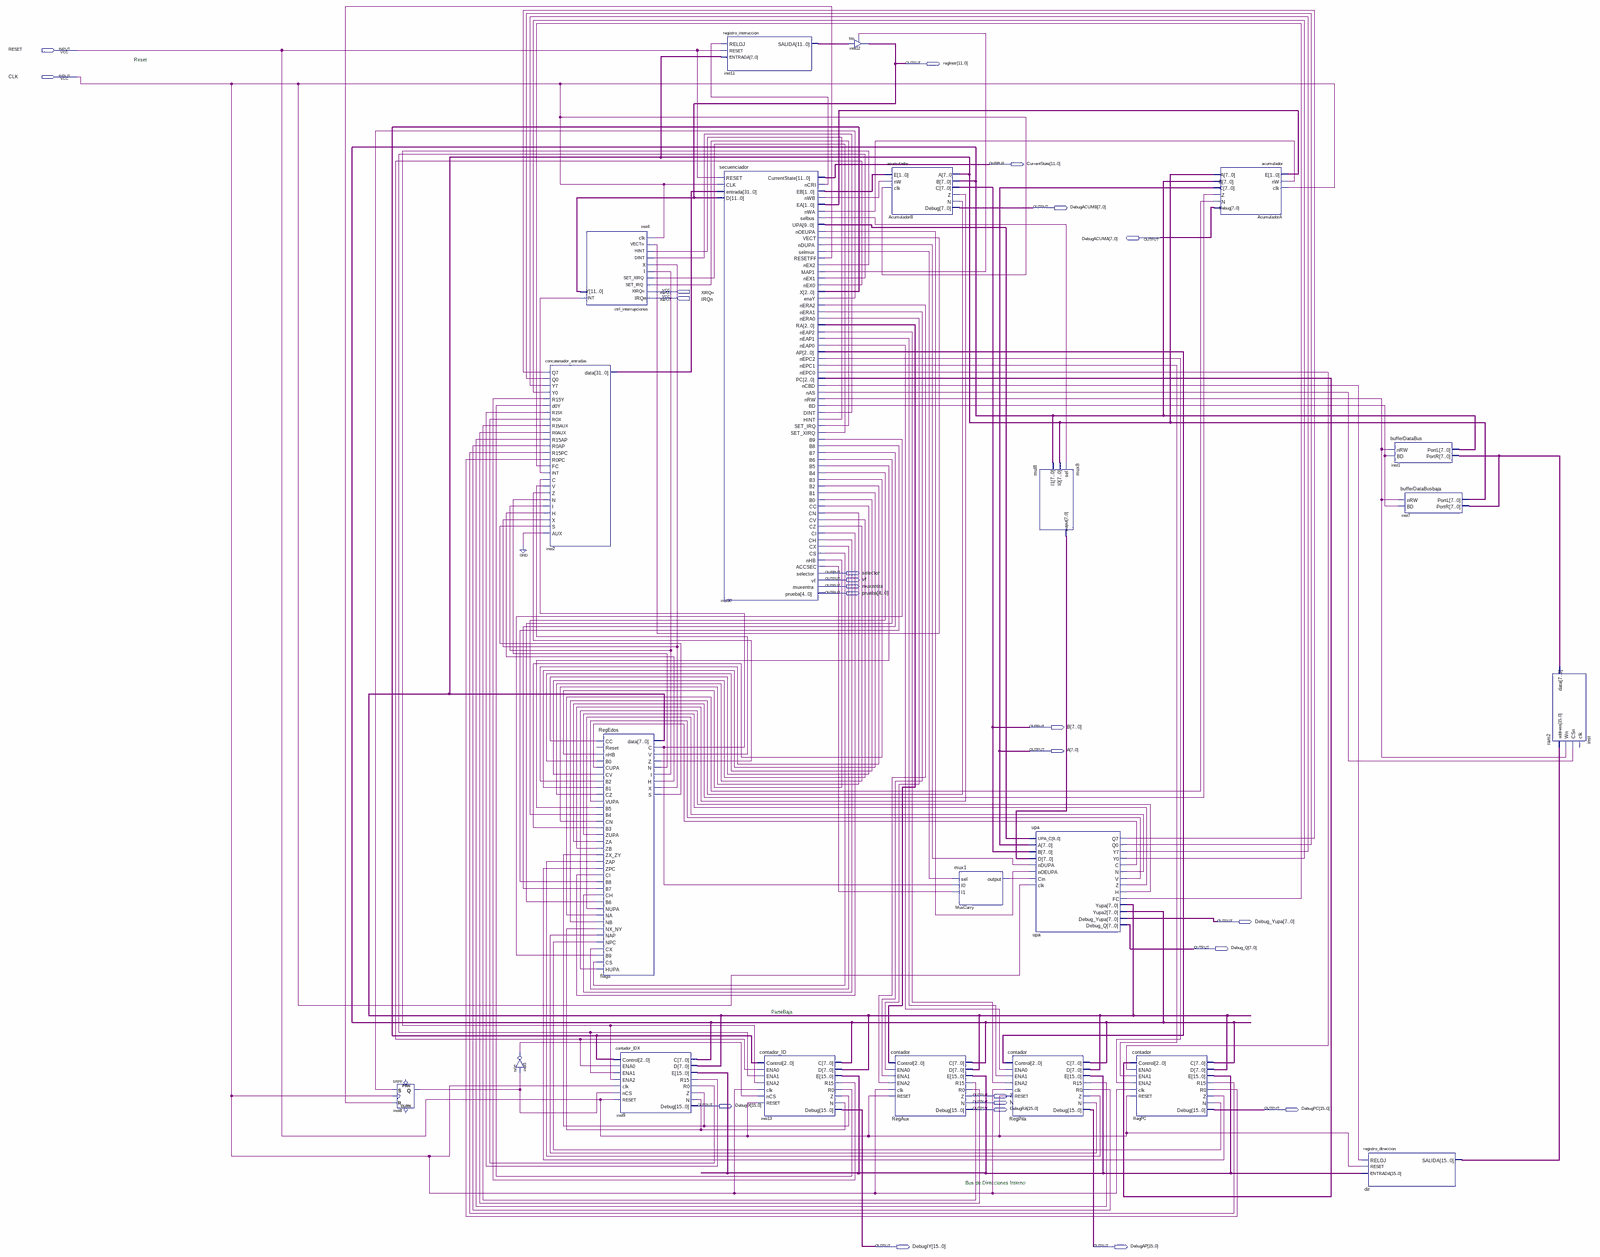
[diagram p0: schematic sheet, whole]
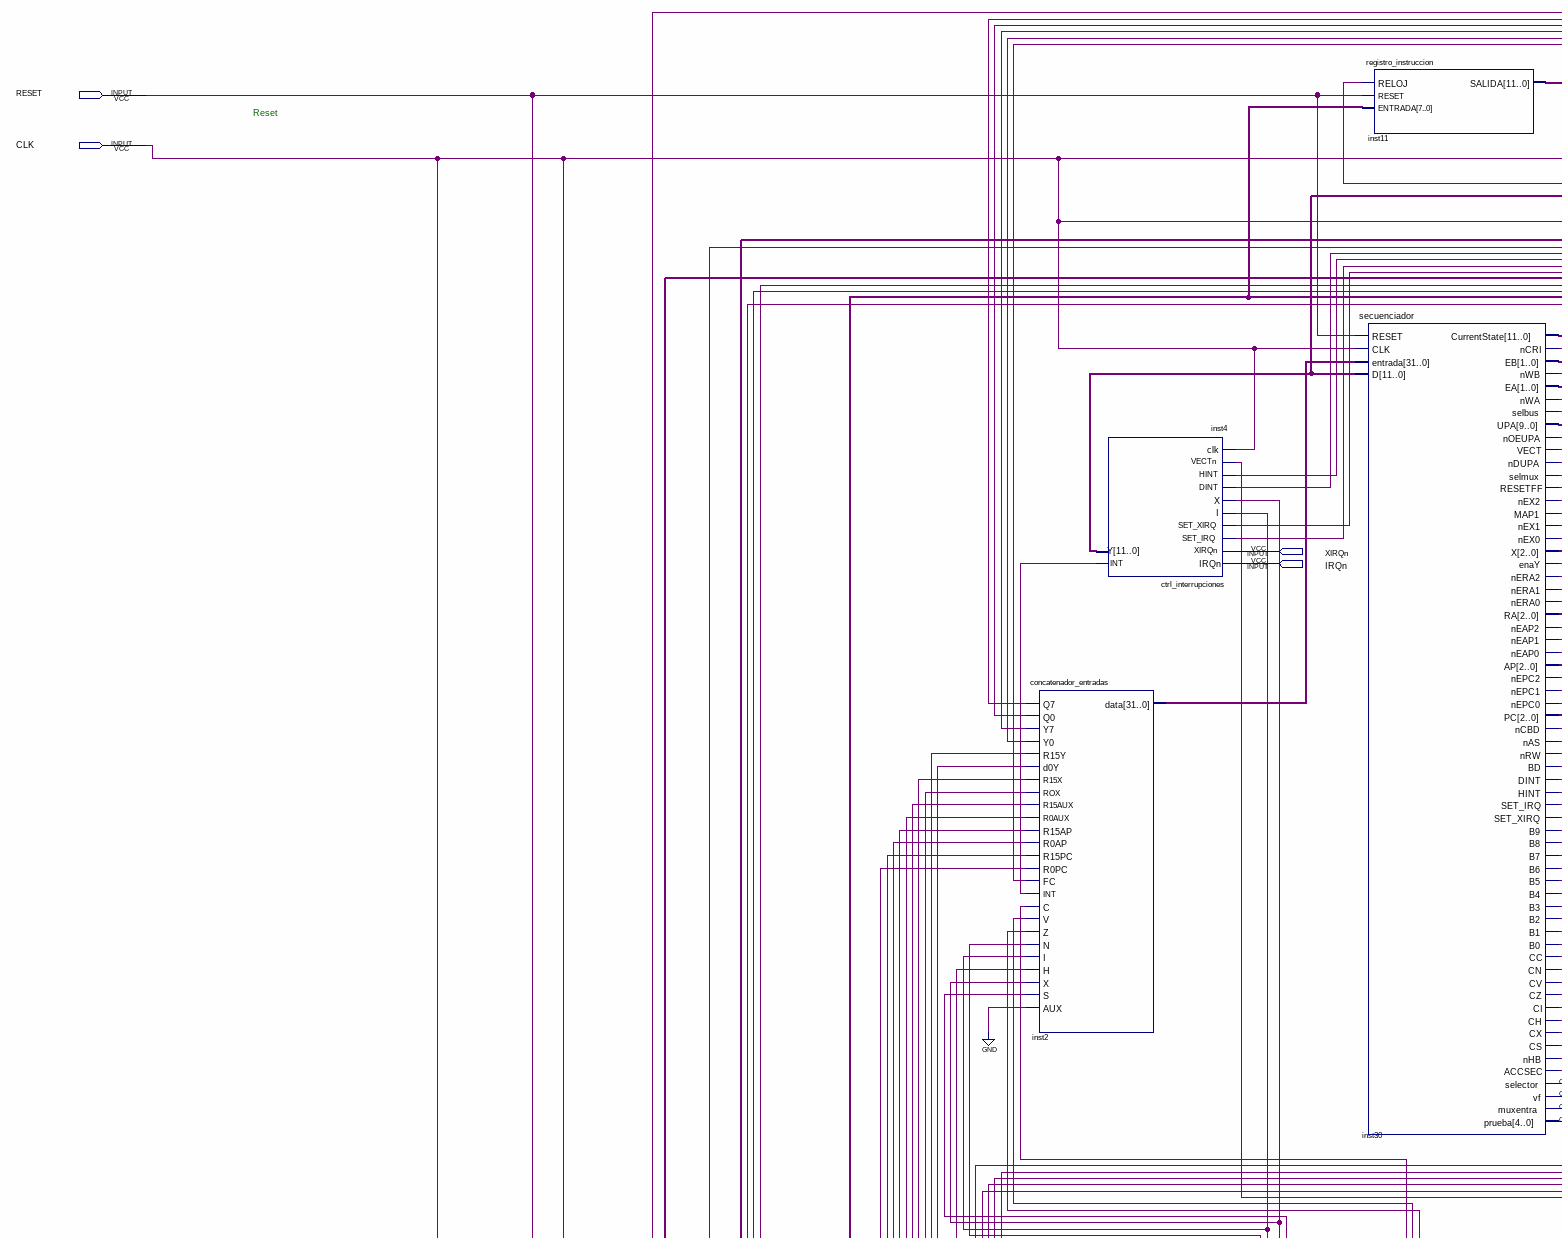
[diagram p1: schematic sheet, upper left part]
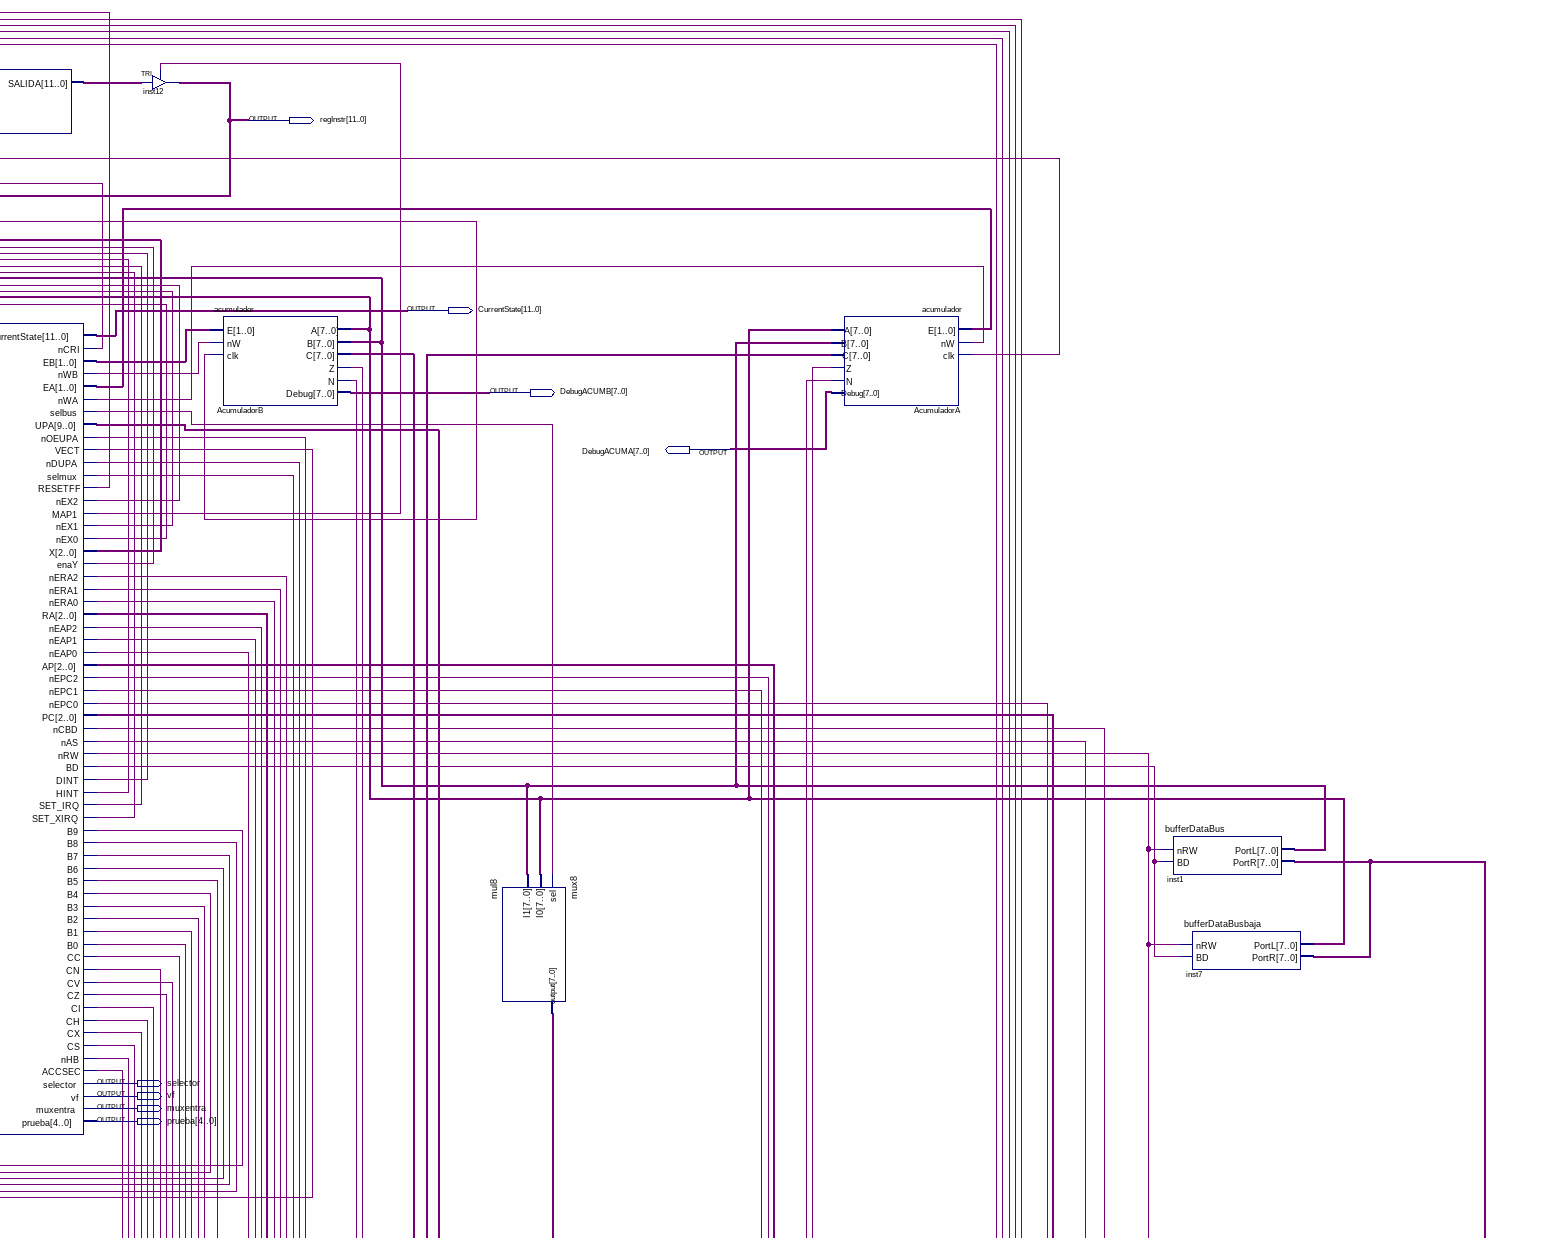
[diagram p2: schematic sheet, upper right part]
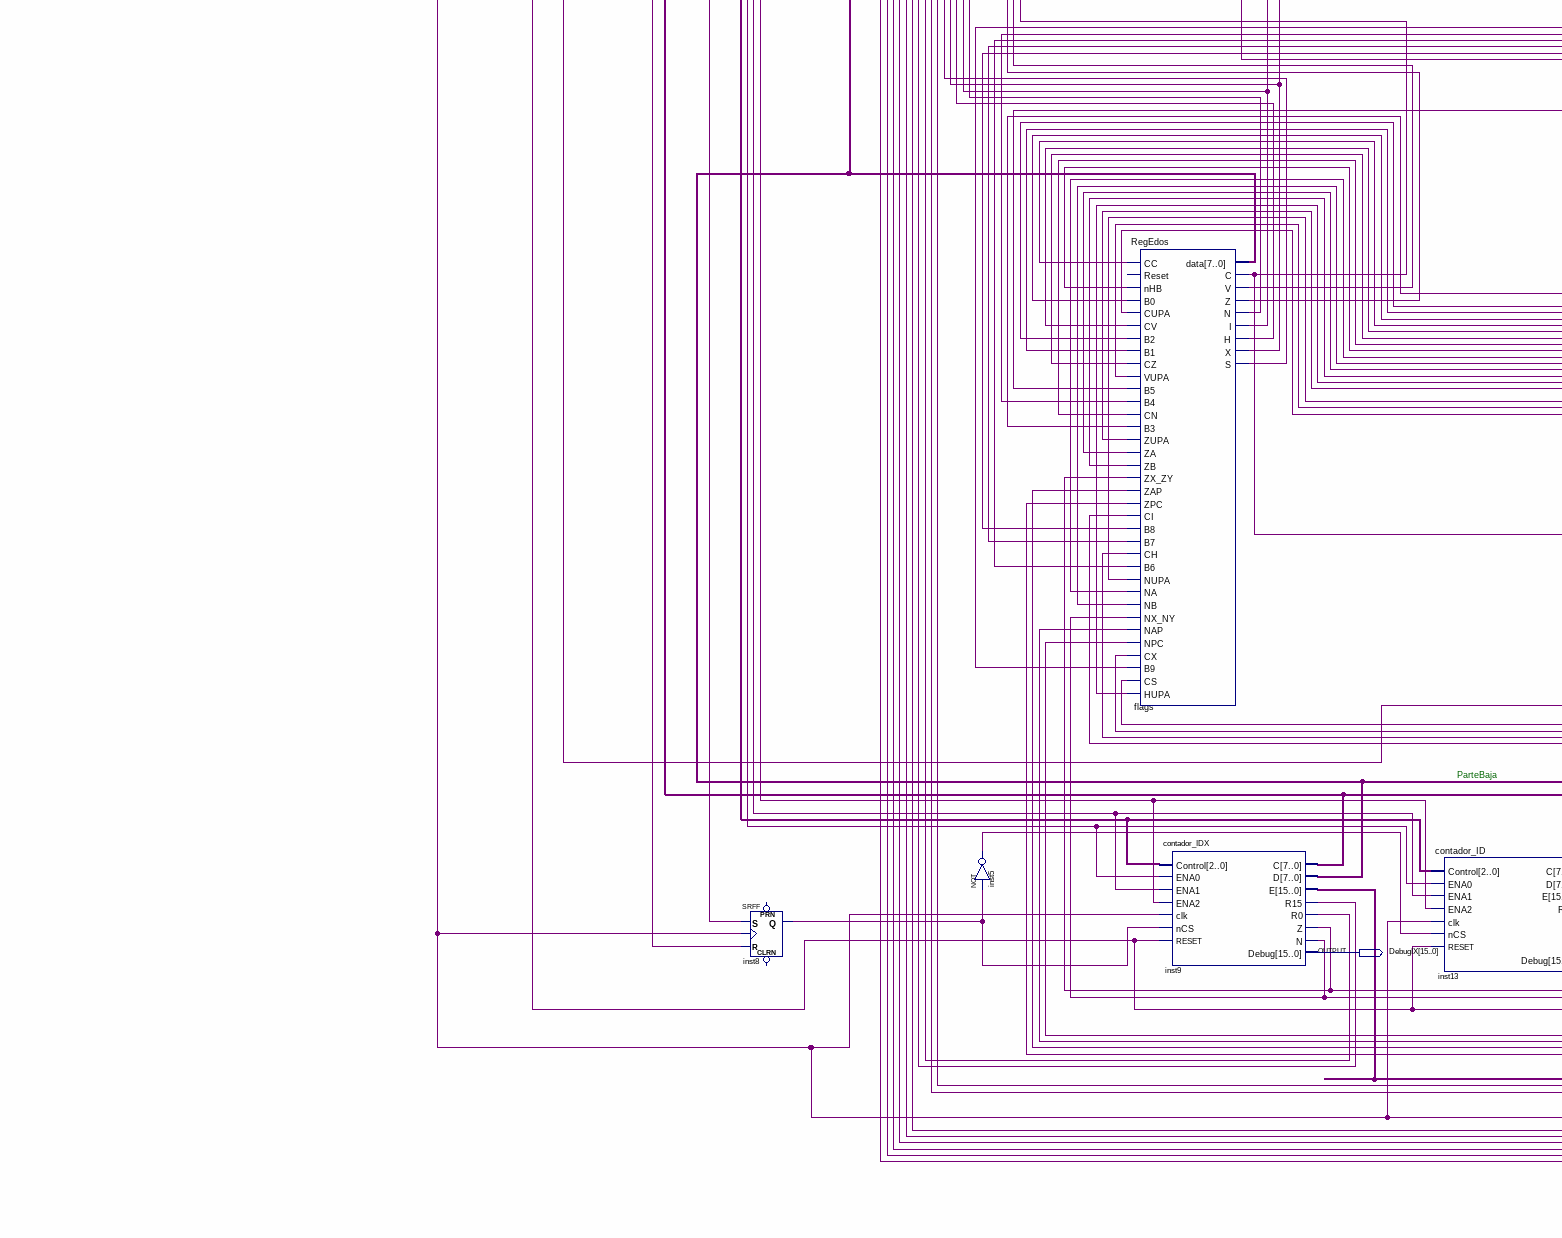
[diagram p3: schematic sheet, lower left part]
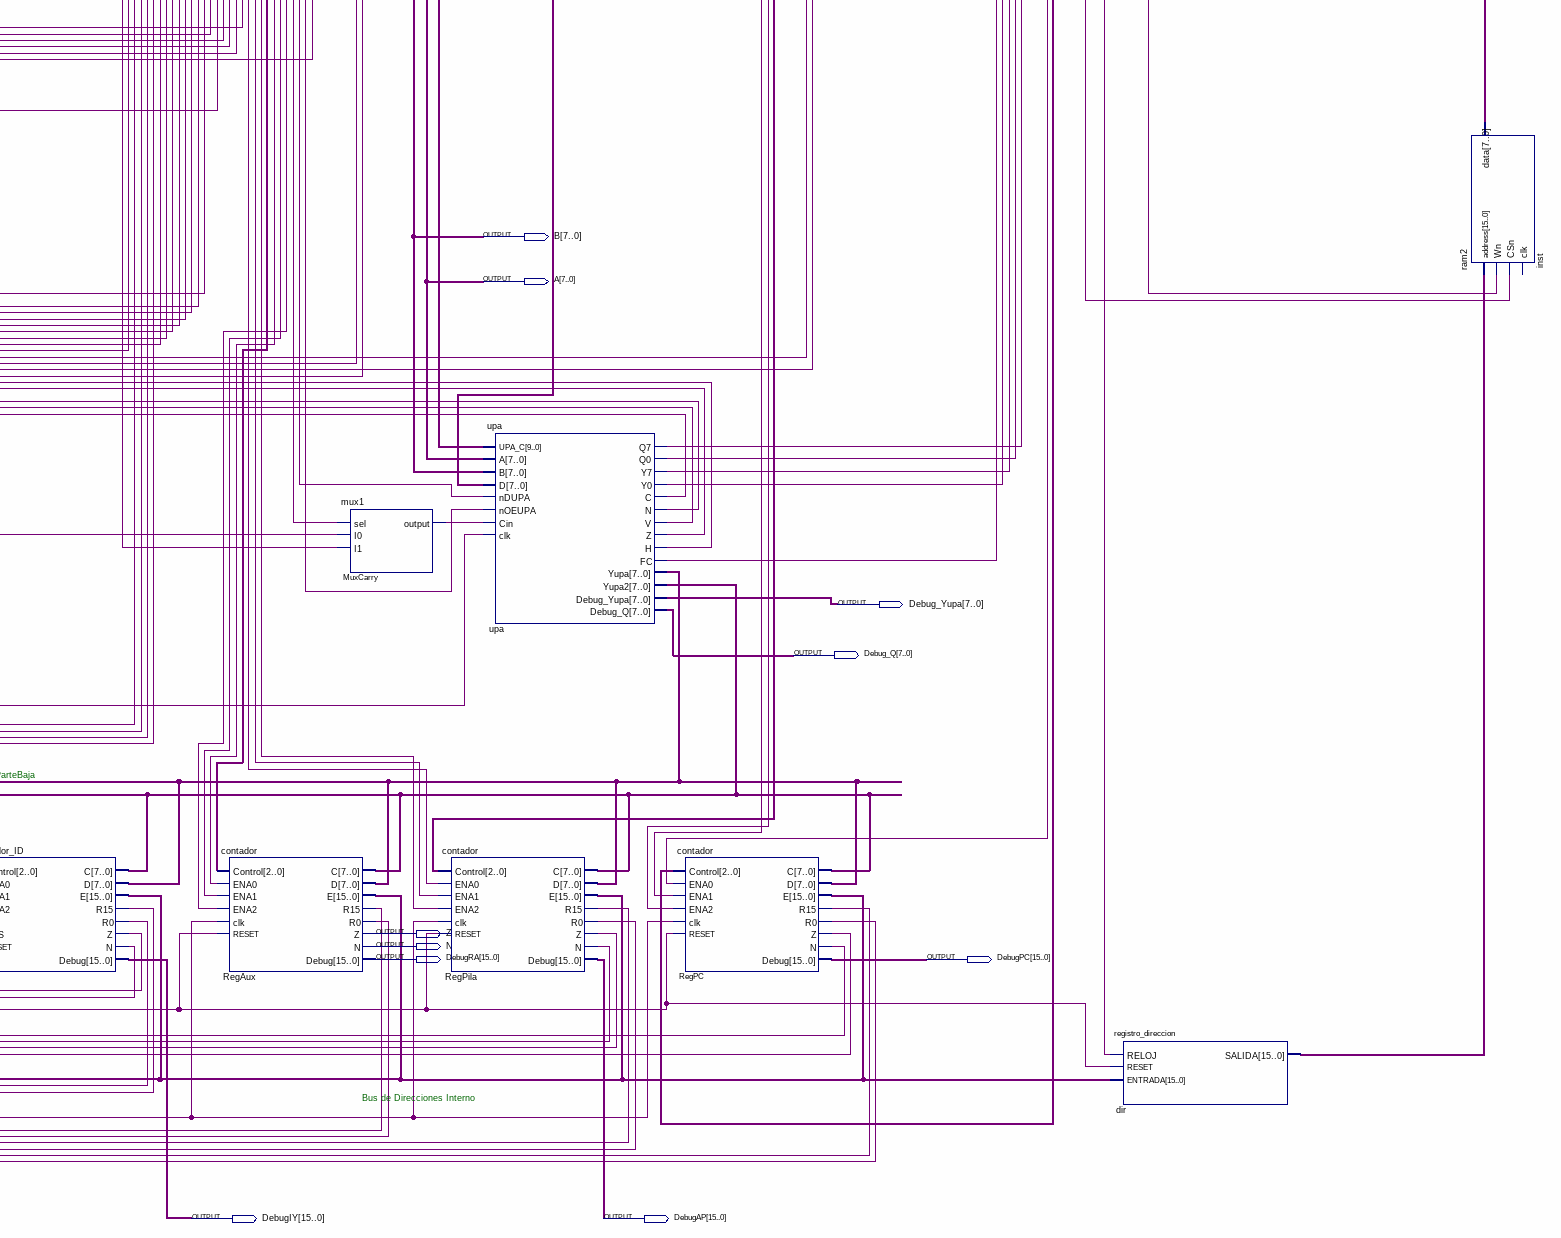
[diagram p4: schematic sheet, lower right part]
// Quartus schematic LOAC_P7_CISC.bdf as structural Verilog: 22 symbols, 23 pins
module LOAC_P7_CISC (
  input  RESET,
  input  CLK,
  input  XIRQn,
  input  IRQn,
  output [11:0] regInstr,
  output [11:0] CurrentState,
  output [7:0] DebugACUMB,
  output [7:0] DebugACUMA,
  output selector,
  output vf,
  output muxentra,
  output [4:0] prueba,
  output [7:0] B,
  output [7:0] A,
  output [7:0] Debug_Yupa,
  output [7:0] Debug_Q,
  output Z,
  output N,
  output [15:0] DebugIX,
  output [15:0] DebugRA,
  output [15:0] DebugPC,
  output [15:0] DebugIY,
  output [15:0] DebugAP
);

  wire AcumuladorA_n, AcumuladorA_z, AcumuladorB_n, AcumuladorB_z, flags_c, flags_h, flags_i, flags_n,
       flags_s, flags_v, flags_x, flags_z, inst4_int, inst5_out, inst8_q, inst9_n, inst9_r0, inst9_r15,
       inst9_z, inst13_r0, inst13_r15, inst30_accsec, inst30_b0, inst30_b1, inst30_b2, inst30_b3, inst30_b4,
       inst30_b5, inst30_b6, inst30_b7, inst30_b8, inst30_b9, inst30_bd, inst30_cc, inst30_ch, inst30_ci,
       inst30_cn, inst30_cs, inst30_cv, inst30_cx, inst30_cz, inst30_dint, inst30_enay, inst30_hint,
       inst30_map1, inst30_nas, inst30_ncbd, inst30_ncri, inst30_ndupa, inst30_neap0, inst30_neap1,
       inst30_neap2, inst30_nepc0, inst30_nepc1, inst30_nepc2, inst30_nera0, inst30_nera1, inst30_nera2,
       inst30_nex0, inst30_nex1, inst30_nex2, inst30_nhb, inst30_noeupa, inst30_nrw, inst30_nwa, inst30_nwb,
       inst30_resetff, inst30_selbus, inst30_selmux, inst30_set_irq, inst30_set_xirq, inst30_vect,
       MuxCarry_output, RegAux_r0, RegAux_r15, RegPC_n, RegPC_r0, RegPC_r15, RegPC_z, RegPila_n, RegPila_r0,
       RegPila_r15, RegPila_z, upa_c, upa_fc, upa_h, upa_n, upa_q0, upa_q7, upa_v, upa_y0, upa_y7, upa_z;
  wire [1:0] inst30_ea, inst30_eb;
  wire [2:0] inst30_ap, inst30_pc, inst30_ra, inst30_x;
  wire [7:0] flags_data, inst1_portr, inst9_c, mul8_output;
  wire [9:0] inst30_upa;
  wire [11:0] inst11_salida;
  wire [15:0] dir_salida, inst9_e;
  wire [31:0] inst2_data;

  SRFF inst8 (.S(inst30_enay), .R(inst30_resetff), .CLK(CLK), .Q(inst8_q));  // open: PRN, CLRN
  not inst5 (inst5_out, inst8_q);
  concatenador_entradas inst2 (
    .Q7(upa_q7), .Q0(upa_q0), .Y7(upa_y7), .Y0(upa_y0), .R15Y(inst13_r15), .d0Y(inst13_r0), .R15X(inst9_r15),
    .ROX(inst9_r0), .R15AUX(RegAux_r15), .R0AUX(RegAux_r0), .R15AP(RegPila_r15), .R0AP(RegPila_r0),
    .R15PC(RegPC_r15), .R0PC(RegPC_r0), .FC(upa_fc), .INT(inst4_int), .C(flags_c), .V(flags_v), .Z(flags_z),
    .N(flags_n), .I(flags_i), .H(flags_h), .X(flags_x), .S(flags_s), .AUX(1'b0), .data(inst2_data));
  ctrl_interrupciones inst4 (
    .IRQn(IRQn), .XIRQn(XIRQn), .SET_IRQ(inst30_set_irq), .SET_XIRQ(inst30_set_xirq), .I(flags_i),
    .X(flags_x), .DINT(inst30_dint), .HINT(inst30_hint), .VECTn(inst30_vect), .clk(CLK), .INT(inst4_int),
    .Y(regInstr));
  RegEdos flags (
    .CC(inst30_cc), .nHB(inst30_nhb), .B0(inst30_b0), .CUPA(upa_c), .CV(inst30_cv), .B2(inst30_b2),
    .B1(inst30_b1), .CZ(inst30_cz), .VUPA(upa_v), .B5(inst30_b5), .B4(inst30_b4), .CN(inst30_cn),
    .B3(inst30_b3), .ZUPA(upa_z), .ZA(AcumuladorA_z), .ZB(AcumuladorB_z), .ZX_ZY(inst9_z), .ZAP(RegPila_z),
    .ZPC(RegPC_z), .CI(inst30_ci), .B8(inst30_b8), .B7(inst30_b7), .CH(inst30_ch), .B6(inst30_b6),
    .NUPA(upa_n), .NA(AcumuladorA_n), .NB(AcumuladorB_n), .NX_NY(inst9_n), .NAP(RegPila_n), .NPC(RegPC_n),
    .CX(inst30_cx), .B9(inst30_b9), .CS(inst30_cs), .HUPA(upa_h), .C(flags_c), .V(flags_v), .Z(flags_z),
    .N(flags_n), .I(flags_i), .H(flags_h), .X(flags_x), .S(flags_s), .data(flags_data));  // open: Reset
  contador_IDX inst9 (
    .Control(inst30_x), .ENA0(inst30_nex0), .ENA1(inst30_nex1), .ENA2(inst30_nex2), .clk(CLK), .nCS(inst8_q),
    .RESET(RESET), .E(inst9_e), .Z(inst9_z), .N(inst9_n), .Debug(DebugIX), .C(inst9_c), .D(flags_data),
    .R15(inst9_r15), .R0(inst9_r0));
  secuenciador inst30 (
    .RESET(RESET), .CLK(CLK), .entrada(inst2_data), .D(regInstr), .CurrentState(CurrentState),
    .prueba(prueba), .muxentra(muxentra), .nCRI(inst30_ncri), .EB(inst30_eb), .vf(vf), .nWB(inst30_nwb),
    .EA(inst30_ea), .nWA(inst30_nwa), .selbus(inst30_selbus), .selector(selector), .UPA(inst30_upa),
    .nOEUPA(inst30_noeupa), .VECT(inst30_vect), .nDUPA(inst30_ndupa), .selmux(inst30_selmux),
    .RESETFF(inst30_resetff), .nEX2(inst30_nex2), .MAP1(inst30_map1), .nEX1(inst30_nex1), .nEX0(inst30_nex0),
    .X(inst30_x), .enaY(inst30_enay), .nERA2(inst30_nera2), .nERA1(inst30_nera1), .nERA0(inst30_nera0),
    .RA(inst30_ra), .nEAP2(inst30_neap2), .nEAP1(inst30_neap1), .nEAP0(inst30_neap0), .AP(inst30_ap),
    .nEPC2(inst30_nepc2), .nEPC1(inst30_nepc1), .nEPC0(inst30_nepc0), .PC(inst30_pc), .nCBD(inst30_ncbd),
    .nAS(inst30_nas), .nRW(inst30_nrw), .BD(inst30_bd), .DINT(inst30_dint), .HINT(inst30_hint),
    .SET_IRQ(inst30_set_irq), .SET_XIRQ(inst30_set_xirq), .B9(inst30_b9), .B8(inst30_b8), .B7(inst30_b7),
    .B6(inst30_b6), .B5(inst30_b5), .B4(inst30_b4), .B3(inst30_b3), .B2(inst30_b2), .B1(inst30_b1),
    .B0(inst30_b0), .CC(inst30_cc), .CN(inst30_cn), .CV(inst30_cv), .CZ(inst30_cz), .CI(inst30_ci),
    .CH(inst30_ch), .CX(inst30_cx), .CS(inst30_cs), .nHB(inst30_nhb), .ACCSEC(inst30_accsec));
  registro_instruccion inst11 (.RELOJ(inst30_ncri), .RESET(RESET), .ENTRADA(flags_data), .SALIDA(inst11_salida));
  contador_ID inst13 (
    .Control(inst30_x), .ENA0(inst30_nex0), .ENA1(inst30_nex1), .ENA2(inst30_nex2), .clk(CLK),
    .nCS(inst5_out), .RESET(RESET), .E(inst9_e), .Z(inst9_z), .N(inst9_n), .Debug(DebugIY), .C(inst9_c),
    .D(flags_data), .R15(inst13_r15), .R0(inst13_r0));
  TRI inst12[11:0] (.IN(inst11_salida), .OE(inst30_map1), .OUT(regInstr));
  acumulador AcumuladorB (
    .E(inst30_eb), .nW(inst30_nwb), .clk(CLK), .Z(AcumuladorB_z), .N(AcumuladorB_n), .Debug(DebugACUMB),
    .A(flags_data), .B(inst9_c), .C(B));
  contador RegAux (
    .Control(inst30_ra), .ENA0(inst30_nera0), .ENA1(inst30_nera1), .ENA2(inst30_nera2), .clk(CLK),
    .RESET(RESET), .E(inst9_e), .Z(Z), .N(N), .Debug(DebugRA), .C(inst9_c), .D(flags_data), .R15(RegAux_r15),
    .R0(RegAux_r0));
  mux1 MuxCarry (.sel(inst30_selmux), .I0(flags_c), .I1(inst30_accsec), .\output (MuxCarry_output));
  contador RegPila (
    .Control(inst30_ap), .ENA0(inst30_neap0), .ENA1(inst30_neap1), .ENA2(inst30_neap2), .clk(CLK),
    .RESET(RESET), .E(inst9_e), .Z(RegPila_z), .N(RegPila_n), .Debug(DebugAP), .C(inst9_c), .D(flags_data),
    .R15(RegPila_r15), .R0(RegPila_r0));
  mux8 mul8 (.sel(inst30_selbus), .I0(flags_data), .I1(inst9_c), .\output (mul8_output));
  upa upa (
    .UPA_C(inst30_upa), .A(A), .B(B), .D(mul8_output), .nDUPA(inst30_ndupa), .nOEUPA(inst30_noeupa),
    .Cin(MuxCarry_output), .clk(CLK), .Q7(upa_q7), .Q0(upa_q0), .Y7(upa_y7), .Y0(upa_y0), .C(upa_c),
    .N(upa_n), .V(upa_v), .Z(upa_z), .H(upa_h), .FC(upa_fc), .Yupa(flags_data), .Yupa2(inst9_c),
    .Debug_Yupa(Debug_Yupa), .Debug_Q(Debug_Q));
  contador RegPC (
    .Control(inst30_pc), .ENA0(inst30_nepc0), .ENA1(inst30_nepc1), .ENA2(inst30_nepc2), .clk(CLK),
    .RESET(RESET), .E(inst9_e), .Z(RegPC_z), .N(RegPC_n), .Debug(DebugPC), .C(inst9_c), .D(flags_data),
    .R15(RegPC_r15), .R0(RegPC_r0));
  acumulador AcumuladorA (
    .E(inst30_ea), .nW(inst30_nwa), .clk(CLK), .Z(AcumuladorA_z), .N(AcumuladorA_n), .Debug(DebugACUMA),
    .A(flags_data), .B(inst9_c), .C(A));
  registro_direccion dir (.RELOJ(inst30_ncbd), .RESET(RESET), .ENTRADA(inst9_e), .SALIDA(dir_salida));
  bufferDataBus inst1 (.nRW(inst30_nrw), .BD(inst30_bd), .PortL(inst9_c), .PortR(inst1_portr));
  bufferDataBusbaja inst7 (.nRW(inst30_nrw), .BD(inst30_bd), .PortL(flags_data), .PortR(inst1_portr));
  ram2 inst (.address(dir_salida), .Wn(inst30_nrw), .CSn(inst30_nas), .data(inst1_portr));  // open: clk

  // Notes on the sheet:
  //   Reset
  //   ParteBaja
  //   Bus de Direcciones Interno
endmodule
